# EAGLE design smarTag_v02 (EAGLE 7.5.0)
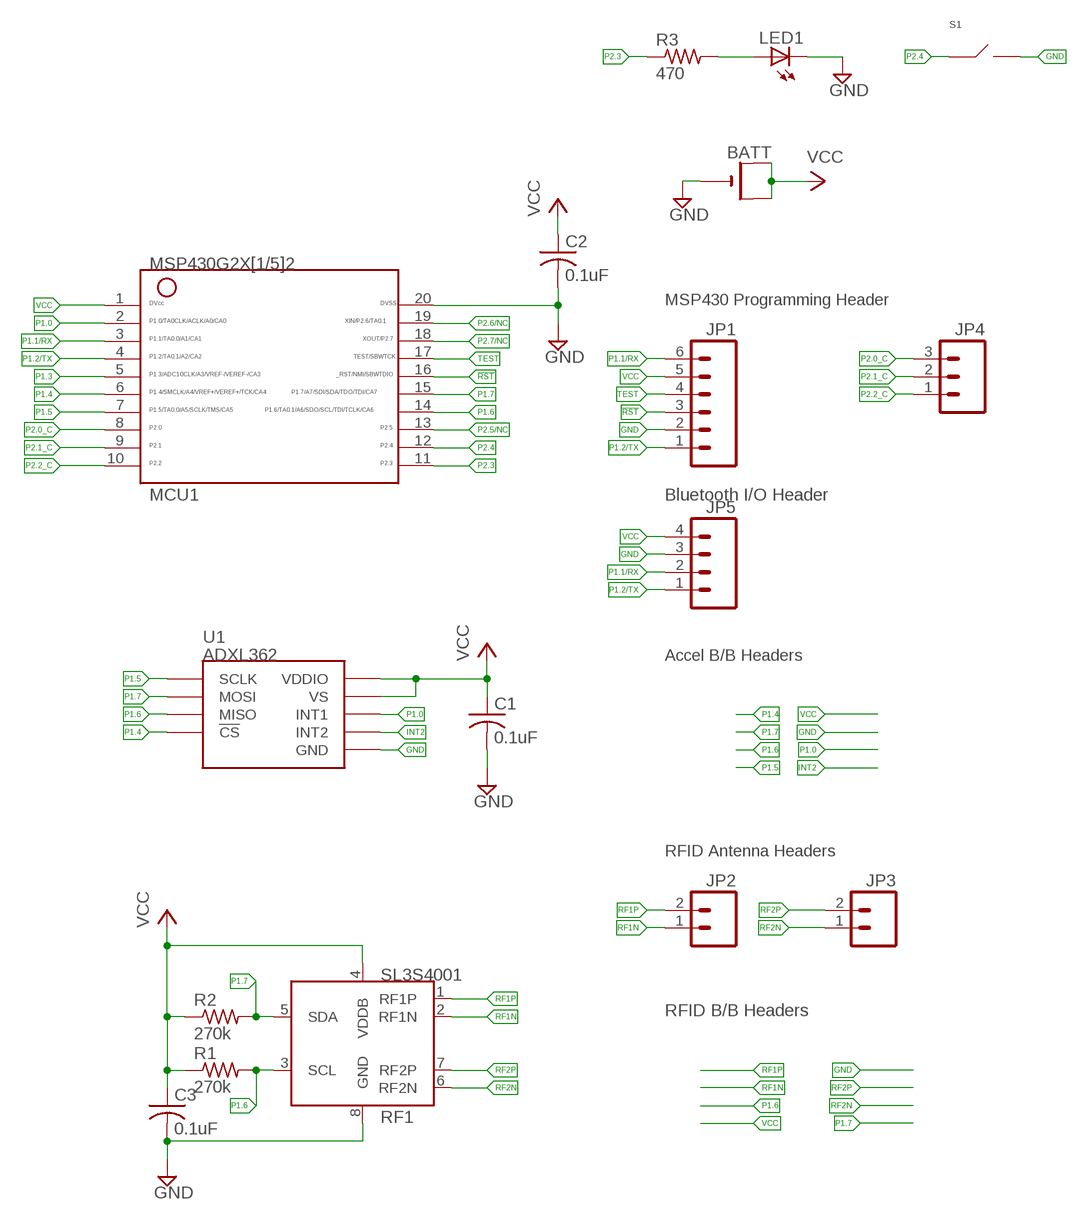
[diagram p0: schematic, sheet 1]

## Parts
BATT  CR2032SMT  [CR2032-SMD]
C1  0.1uF  C-USC0805  [C0805]
C2  0.1uF  C-USC0805K  [C0805K]
C3  0.1uF  C-USC0805  [C0805]
JP1  M061.27MM  [1X06-1.27MM]
JP2  M02LOCK  [1X02_LOCK]
JP3  M02LOCK  [1X02_LOCK]
JP4  M03LOCK  [1X03_LOCK]
JP5  M04LOCK  [1X04_LOCK]
LED1  LEDCHIP-LED0805  [CHIP-LED0805]
MCU1  G2X[1/5]2---PW20  [PW20]
R1  270k  R-US_R0805  [R0805]
R2  270k  R-US_R0805  [R0805]
R3  470  R-US_R0805  [R0805]
RF1  SL3S4001  [SOT902-1/2/3]
S1  SPST_B3FS-1000  [B3FS-1000]
U1  ADXL362  [ADXL362]

## Nets
!RST: JP1.3 MCU1.16
GND: BATT.- C1.2 C2.2 C3.2 JP1.2 JP5.3 LED1.C MCU1.20 RF1.8(GND) S1.3(B) S1.4(B) U1.P$12(GND) U1.P$13(GND) U1.P$16(GND)
INT2: U1.P$9(INT2)
N$1: LED1.A R3.2
P1.0: MCU1.2 U1.P$11(INT1)
P1.1/RX: JP1.6 JP5.2 MCU1.3
P1.2/TX: JP1.1 JP5.1 MCU1.4
P1.3: MCU1.5
P1.4: MCU1.6 U1.P$8(!CS)
P1.5: MCU1.7 U1.P$4(SCLK)
P1.6: MCU1.14 R1.2 RF1.3(SCL) U1.P$7(MISO)
P1.7: MCU1.15 R2.2 RF1.5(SDA) U1.P$6(MOSI)
P2.0_C [cap_sensor]: JP4.3 MCU1.8
P2.1_C [cap_sensor]: JP4.2 MCU1.9
P2.2_C [cap_sensor]: JP4.1 MCU1.10
P2.3: MCU1.11 R3.1
P2.4: MCU1.12 S1.1(A) S1.2(A)
P2.5/NC: MCU1.13
P2.6/NC: MCU1.19
P2.7/NC: MCU1.18
RF1N: JP2.1 RF1.2(RF1N)
RF1P: JP2.2 RF1.1(RF1P)
RF2N: JP3.1 RF1.6(RF2N)
RF2P: JP3.2 RF1.7(RF2P)
TEST: JP1.4 MCU1.17
VCC: BATT.+$1(+) BATT.+$2(+1) C1.1 C2.1 C3.1 JP1.5 JP5.4 MCU1.1 R1.1 R2.1 RF1.4(VDDB) U1.P$1(VDDIO) U1.P$14(VS)

## Notes on the sheet
- MSP430 Programming Header
- Bluetooth I/O Header
- Accel B/B Headers
- RFID Antenna Headers
- RFID B/B Headers

## Library data of the parts
BATT = adafruit:CR2032
C1-C3 = rcl:C-US: CAPACITOR, American symbol
JP1 = SparkFun-Connectors:M06: Header 6 Standard 6-pin 0.1" header. Use with straight break away headers (SKU : PRT-00116), right angle break away headers (PRT-00553), swiss pins (PRT-00743), machine pins (PRT-00117), and female headers (PRT-00115). Molex polarized connector foot print use with SKU : PRT-08094 with associated crimp pins and housings. NOTES ON THE VARIANTS LOCK and LOCK_LONGPADS... This footprint was designed to help hold the alignment of a through-hole component (i.e. 6-pin header) while soldering it into place. You may notice that each hole has been shifted either up or down by 0.005 of an inch from it's more standard position (which is a perfectly straight line). This slight alteration caused the pins (the squares in the middle) to touch the edges of the holes. Because they are alternating, it causes a "brace" to hold the component in place. 0.005 has proven to be the perfect amount of "off-center" position when using our standard breakaway headers. Although looks a little odd when you look at the bare footprint, once you have a header in there, the alteration is very hard to notice. Also,if you push a header all the way into place, it is covered up entirely on the bottom side. This idea of altering the position of holes to aid alignment will be further integrated into the Sparkfun Library for other footprints. It can help hold any component with 3 or more connection pins.
JP2 JP3 = SparkFun-Connectors:M02: Standard 2-pin 0.1" header. Use with - straight break away headers ( PRT-00116) - right angle break away headers (PRT-00553) - swiss pins (PRT-00743) - machine pins (PRT-00117) - female headers (PRT-00115) Molex polarized connector foot print use with: PRT-08233 with associated crimp pins and housings. 2.54_SCREWTERM for use with PRT-10571. 3.5mm Screw Terminal footprints for PRT-08084 5mm Screw Terminal footprints for use with PRT-08432
JP4 = SparkFun-Connectors:M03: Header 3 Standard 3-pin 0.1" header. Use with straight break away headers (SKU : PRT-00116), right angle break away headers (PRT-00553), swiss pins (PRT-00743), machine pins (PRT-00117), and female headers (PRT-00115). Molex polarized connector foot print use with SKU : PRT-08232 with associated crimp pins and housings.
JP5 = SparkFun-Connectors:M04: Header 4 Standard 4-pin 0.1" header. Use with straight break away headers (SKU : PRT-00116), right angle break away headers (PRT-00553), swiss pins (PRT-00743), machine pins (PRT-00117), and female headers (PRT-00115). Molex polarized connector foot print use with SKU : PRT-08231 with associated crimp pins and housings. 1MM SMD Version SKU: PRT-10208; PROD_ID: CONN-09696
LED1 = led:LED: LED OSRAM: - CHIPLED LG R971, LG N971, LY N971, LG Q971, LY Q971, LO R971, LY R971 LH N974, LH R974 LS Q976, LO Q976, LY Q976 LO Q996 - Hyper CHIPLED LW Q18S LB Q993, LB Q99A, LB R99A - SideLED LS A670, LO A670, LY A670, LG A670, LP A670 LB A673, LV A673, LT A673, LW A673 LH A674 LY A675 LS A676, LA A676, LO A676, LY A676, LW A676 LS A679, LY A679, LG A679 - Hyper Micro SIDELED® LS Y876, LA Y876, LO Y876, LY Y876 LT Y87S - SmartLED LW L88C, LW L88S LB L89C, LB L89S, LG L890 LS L89K, LO L89K, LY L89K LS L896, LA L896, LO L896, LY L896 - TOPLED LS T670, LO T670, LY T670, LG T670, LP T670 LSG T670, LSP T670, LSY T670, LOP T670, LYG T670 LG T671, LOG T671, LSG T671 LB T673, LV T673, LT T673, LW T673 LH T674 LS T676, LA T676, LO T676, LY T676, LB T676, LH T676, LSB T676, LW T676 LB T67C, LV T67C, LT T67C, LS T67K, LO T67K, LY T67K, LW E67C LS E67B, LA E67B, LO E67B, LY E67B, LB E67C, LV E67C, LT E67C LW T67C LS T679, LY T679, LG T679 LS T770, LO T770, LY T770, LG T770, LP T770 LB T773, LV T773, LT T773, LW T773 LH T774 LS E675, LA E675, LY E675, LS T675 LS T776, LA T776, LO T776, LY T776, LB T776 LHGB T686 LT T68C, LB T68C - Hyper Mini TOPLED® LB M676 - Mini TOPLED Santana® LG M470 LS M47K, LO M47K, LY M47K Source: http://www.osram.convergy.de LUXEON: - LUMILED® LXK2-PW12-R00, LXK2-PW12-S00, LXK2-PW14-U00, LXK2-PW14-V00 LXK2-PM12-R00, LXK2-PM12-S00, LXK2-PM14-U00 LXK2-PE12-Q00, LXK2-PE12-R00, LXK2-PE12-S00, LXK2-PE14-T00, LXK2-PE14-U00 LXK2-PB12-K00, LXK2-PB12-L00, LXK2-PB12-M00, LXK2-PB14-N00, LXK2-PB14-P00, LXK2-PB14-Q00 LXK2-PR12-L00, LXK2-PR12-M00, LXK2-PR14-Q00, LXK2-PR14-R00 LXK2-PD12-Q00, LXK2-PD12-R00, LXK2-PD12-S00 LXK2-PH12-R00, LXK2-PH12-S00 LXK2-PL12-P00, LXK2-PL12-Q00, LXK2-PL12-R00 Source: www.luxeon.com KINGBRIGHT: KA-3528ASYC Source: www.kingbright.com
MCU1 = TI_MSP430_v16:G2X[1/5]2---PW20: MSP430G2X[1/5]2 MSP430G2x52, MSP430G2x12 TSSOP (PW) 20 Pin Package http://focus.ti.com/docs/prod/folders/print/msp430g2452.html
R1-R3 = rcl:R-US_: RESISTOR, American symbol
RF1 = NXP_60_26022015:SL3S4001: The UHF EPCglobal Generation 2 standard allows the commercialized provision of mass adoption of UHF RFID technology for passive smart tags and labels. Main fields of applications are supply chain management and logistics for worldwide use with special consideration of European, US and Chinese frequencies to ensure that operating distances of several meters can be realized. The UCODE I2C is a product out of the NXP Semiconductors UCODE product family. The entire UCODE product family offers anti-collision and collision arbitration functionality. This allows a reader to simultaneously operate multiple labels/tags within its antenna field. A UCODE I2C based label/ tag requires no external power supply for contactless operation. Its contactless interface generates the power supply via the antenna circuit by propagative energy transmission from the interrogator (reader), while the system clock is generated by an on-chip oscillator. Data transmitted from the interrogator to the label/tag is demodulated by the interface, and it also modulates the interrogator's electromagnetic field for data transmission from the label/tag to the interrogator. A label/tag can be operated without the need for line of sight or battery, as long as it is connected to a dedicated antenna for the targeted frequency range. When the label/tag is within the interrogator's operating range, the high-speed wireless interface allows data transmission in both directions. The UCODE I2C also features an I2C interface to read/write data from its build in memory. In this mode the UCODE I2C needs to be supplied externally. The I2C interface supports standard and fast I2C modes. The used EEPROM is based on a field proven non-volatile memory technology. The EEPROM memory cell is also used in high quality automotive applications. AAL Eindhoven MK
S1 = PP_Electromechanical:SPST: SPST Switches
U1 = SparkFun-Sensors:ADXL362: Micropower 3-axis accelerometer 2/4/8g digital output (SPI) IC-11297; PROD_ID: IC-11297

## Net classes
0 default: width 0.254 mm
1 cap_sensor: width 0.254 mm

## Board
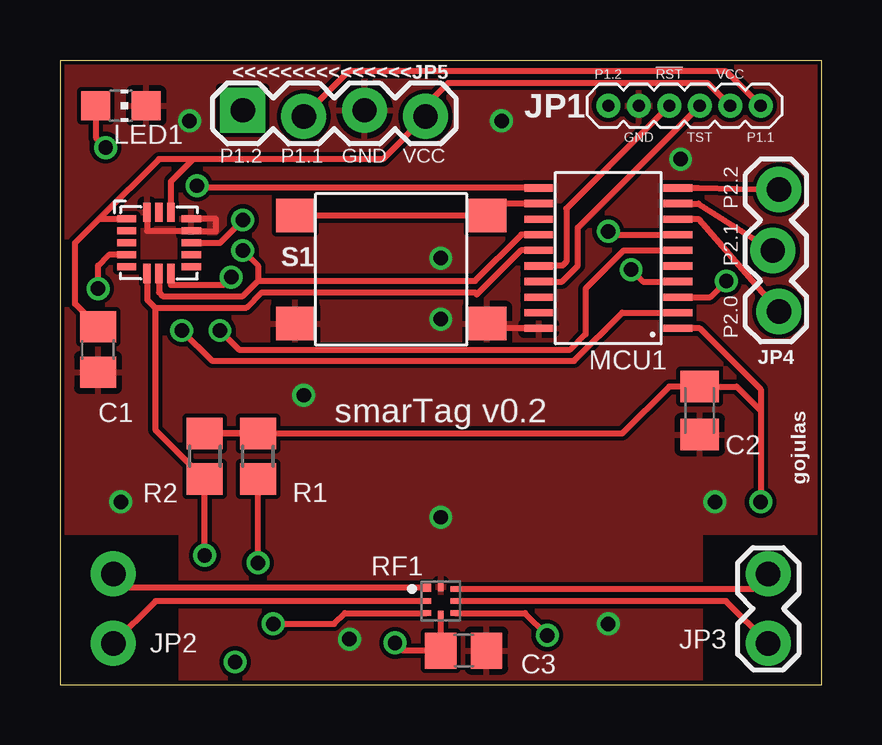
[diagram p1: board, top side]
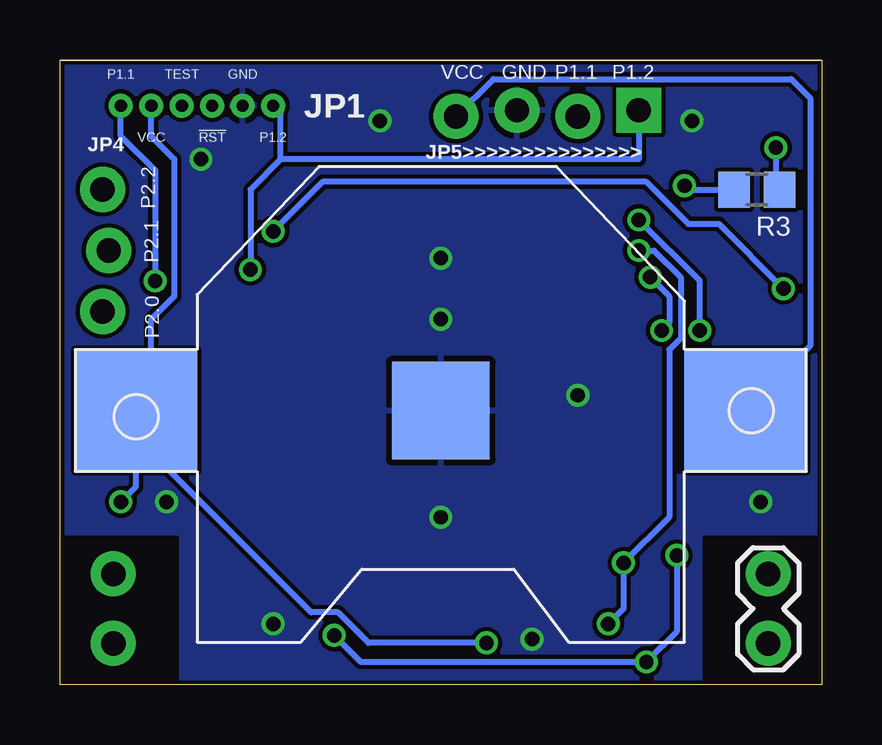
[diagram p2: board, bottom side, seen from below]

Size 31.75 x 26.04 mm. Coordinates in mm from the lower left corner, seen from the top.
Outline: 31.75,26.02 31.75,0 0,0 0,26.02 31.75,26.02
Outline: 31.75,26.02 31.75,26.04
Copper layers (1*16): Top 0.035mm / dielectric 1.5mm / Bottom 0.035mm
Design rules "SparkFun-2-layer-TIGHT *": minimum track width 7mil, minimum drill 15mil, track to track 7mil, track to pad 7mil, pad to pad 7mil, via to via 7mil, smd to smd 7mil, copper to edge 7mil, drill to drill 7mil, minimum pad ring 7mil, minimum via ring 7mil, stop-mask expansion 4mil, vias tented up to drill 25mil, thermal gap 10mil

### Footprints (pad centres in the part's own frame; a part is rotated, then mirrored left to right if it is on the bottom)
CR2032-SMD = smd 5.08 x 5.08: +$1 -12.7,0; +$2 12.7,0 | smd 4.064 x 4.064: - 0,0
C0805 = smd 1.3 x 1.5: 1 -0.95,0; 2 0.95,0
C0805K = smd 1.3 x 1.6: 1 -1,0; 2 1,0
1X06-1.27MM = drill 0.508 pad 1: 1 0,0; 2 1.27,0; 3 2.54,0; 4 3.81,0; 5 5.08,0; 6 6.35,0
1X02_LOCK = drill 1.016 pad 1.88: 1 -0.178,0; 2 2.718,0
1X03_LOCK = drill 1.016 pad 1.88: 1 0,0.127; 2 2.54,-0.127; 3 5.08,0.127
1X04_LOCK = drill 1.016 pad 1.88 square: 1 0,0.127 | drill 1.016 pad 1.88: 2 2.54,-0.127; 3 5.08,0.127; 4 7.62,-0.127
CHIP-LED0805 = smd 1.2 x 1.2: A 0,-1.05; C 0,1.05
PW20 = smd 0.3 x 1.2: 1 -2.925,-2.9; 2 -2.275,-2.9; 3 -1.625,-2.9; 4 -0.975,-2.9; 5 -0.325,-2.9; 6 0.325,-2.9; 7 0.975,-2.9; 8 1.625,-2.9; 9 2.275,-2.9; 10 2.925,-2.9; 11 2.925,2.9; 12 2.275,2.9; 13 1.625,2.9; 14 0.975,2.9; 15 0.325,2.9; 16 -0.325,2.9; 17 -0.975,2.9; 18 -1.625,2.9; 19 -2.275,2.9; 20 -2.925,2.9
R0805 = smd 1.3 x 1.5: 1 -0.95,0; 2 0.95,0
SOT902-1/2/3 = smd 0.4 x 0.32: 1 0.6,-0.55 | smd 0.4 x 0.22: 2 0.6,0; 3 0.6,0.5; 5 -0.6,0.5; 6 -0.6,0; 7 -0.6,-0.5 | smd 0.22 x 0.4: 4 0,0.6; 8 0,-0.6
B3FS-1000 = smd 1.6 x 1.4: 1 4,-2.25; 2 -4,-2.25; 3 4,2.25; 4 -4,2.25
ADXL362 = smd 0.8 x 0.3: P$1 -1.35,1; P$2 -1.35,0.5; P$3 -1.35,0; P$4 -1.35,-0.5; P$5 -1.35,-1; P$9 1.35,-1; P$10 1.35,-0.5; P$11 1.35,0; P$12 1.35,0.5; P$13 1.35,1 | smd 0.3 x 0.8: P$6 -0.5,-1.275; P$7 0,-1.275; P$8 0.5,-1.275; P$14 0.5,1.275; P$15 0,1.275; P$16 -0.5,1.275

### Placement (x,y rotation side)
BATT  15.88,11.43 180 bottom
C1  1.59,13.97 270 top
C2  26.67,11.43 270 top
C3  16.83,1.43 0 top
JP1  22.86,24.13 0 top
JP2  2.22,1.91 90 bottom
JP3  29.53,1.91 90 top
JP4  29.84,20.64 270 top
JP5  7.62,23.81 0 top
LED1  2.54,24.13 270 top
MCU1  22.86,17.78 90 top
R1  8.26,9.53 270 top
R2  6.03,9.53 270 top
R3  2.7,20.64 0 bottom
RF1  15.88,3.49 180 top
S1  13.81,17.3 180 top
U1  4.13,18.41 0 top

### Tracks (layer width: path | path; a pad name or v marks a point on that pad's centre or on a via)
!RST
  Top 0.254: MCU1.16 20.95,17.46 21.11,17.62 21.11,19.84 JP1.3
GND  (via drill 0.6)
  Top 0.254: U1.P$16 3.63,18.91 U1.P$12 5.48,18.89 6.51,18.89 6.51,19.41 U1.P$13 | MCU1.20 18.01,14.86 S1.4
  other vias: 27.3,7.62 22.86,2.54 2.54,7.62 15.88,15.24 10.16,12.06 15.88,6.99 25.88,21.91 5.4,23.5 15.88,17.78 18.41,23.5 12.06,1.91
  pour Top: -2.54,30.48 34.29,30.48 34.29,6.35 26.67,6.35 26.67,-2.54 5.08,-2.54 5.08,6.35 -2.54,6.35
  pour Bottom: -1.27,6.35 -1.27,29.21 33.02,29.21 33.02,6.35 26.67,6.35 26.67,-1.27 5.08,-1.27 5.08,6.35
N$1  (via drill 0.6)
  Top 0.254: LED1.A 1.49,22.8 v1.91,22.38
  Bottom 0.254: v1.91,22.38 1.91,20.64 R3.2
P1.0  (via drill 0.6)
  Top 0.254: v5.08,14.76 6.35,13.49 21.43,13.49 23.44,15.51 MCU1.2 | U1.P$11 6.67,18.41 v7.62,19.37
  Bottom 0.254: v5.08,14.76 5.08,16.83 v7.62,19.37
P1.1/RX  (via drill 0.6)
  Top 0.254: JP5.2 12.03,25.56 27.78,25.56 JP1.6 | MCU1.3 27.11,16.16 v27.78,16.83
  Bottom 0.254: v27.78,16.83 27.78,21.43 29.21,22.86 JP1.6
P1.2/TX  (via drill 0.6)
  Top 0.254: MCU1.4 24.31,16.8 v23.81,17.3
  Bottom 0.254: JP5.1 7.62,21.91 22.54,21.91 | 22.54,21.91 23.81,20.64 v23.81,17.3 | 22.54,21.91 22.54,23.81 JP1.1
P1.4  (via drill 0.6)
  Top 0.254: MCU1.6 25.75,18.1 23.5,18.1 21.91,16.51 21.91,14.61 21.27,13.97 7.46,13.97 v6.67,14.76 | U1.P$8 4.63,16.67 6.83,16.67 v7.14,16.99
  Bottom 0.254: v6.67,14.76 6.35,15.08 6.35,16.19 v7.14,16.99
P1.5  (via drill 0.6)
  Top 0.254: MCU1.7 25.74,18.73 23.02,18.73 v22.86,18.89 | U1.P$4 2.04,17.91 1.59,17.46 v1.59,16.51
  Bottom 0.254: v1.59,16.51 4.29,19.21 5.56,19.21 7.3,20.95 20.8,20.95 v22.86,18.89
P1.6  (via drill 0.6)
  Top 0.254: v8.26,5.08 R1.2 | U1.P$7 4.13,16.35 4.29,16.19 7.62,16.19 8.26,16.83 | RF1.3 11.88,2.99 11.43,2.54 v8.89,2.54 | MCU1.14 19.23,18.75 17.3,16.83 8.26,16.83 | v7.62,18.1 8.26,17.46 8.26,16.83
  Bottom 0.254: v8.89,2.54 8.26,3.17 v8.26,5.08 6.35,6.99 6.35,13.97 5.87,14.45 5.87,16.99 6.99,18.1 v7.62,18.1
P1.7  (via drill 0.6)
  Top 0.254: v6.03,5.4 R2.2 3.97,10.64 3.97,15.72 | 3.97,15.72 3.65,16.03 3.65,17.12 U1.P$6 | RF1.5 19.39,2.99 v20.32,2.06 | MCU1.15 19.22,18.11 17.38,16.27 17.3,16.35 8.41,16.35 7.78,15.72 3.97,15.72
  Bottom 0.254: v20.32,2.06 19.21,0.95 v7.3,0.95 6.03,2.22 v6.03,5.4
P2.0_C
  Top 0.254: MCU1.8 26.63,19.41 JP4.3
P2.1_C
  Top 0.254: MCU1.9 26.62,20.05 JP4.2
P2.2_C
  Top 0.254: MCU1.10 26.6,20.7 JP4.1
P2.3  (via drill 0.6)
  Top 0.254: MCU1.11 5.81,20.7 v5.71,20.8
  Bottom 0.254: v5.71,20.8 5.56,20.64 R3.1
P2.4
  Top 0.254: MCU1.12 18.31,20.05 S1.2 S1.1
RF1N
  Top 0.254: 2.72,2.22 JP2.1 3.99,3.49 RF1.2
RF1P
  Top 0.254: RF1.1 2.8,4.04 JP2.2
RF2N
  Top 0.254: JP3.1 27.76,3.49 RF1.6
RF2P
  Top 0.254: JP3.2 28.9,3.99 RF1.7
TEST
  Top 0.254: MCU1.17 20.93,16.8 21.59,17.46 21.59,19.05 JP1.4
VCC  (via drill 0.6)
  Top 0.254: MCU1.1 26.67,14.86 29.21,12.31 29.21,11.43 | C1.1 0.64,15.87 0.64,18.41 1.64,19.41 | 1.64,19.41 U1.P$1 | R1.1 R2.1 23.45,10.47 25.4,12.43 C2.1 28.21,12.43 29.21,11.43 | RF1.4 C3.1 14.29,1.43 v13.97,1.75 | 5.56,21.91 13.46,21.91 JP5.4 15.24,24.13 16.19,25.08 26.99,25.08 JP1.5 | 5.56,21.91 4.13,21.91 1.64,19.41 | U1.P$14 4.63,20.98 5.56,21.91 | 29.21,11.43 v29.21,7.62
  Bottom 0.254: 3.17,9.53 BATT.+$1 0.48,14.13 0.48,24.45 1.27,25.24 13.68,25.24 JP5.4 | v13.97,1.75 18.89,1.75 20.16,3.02 21.27,3.02 28.57,10.32 BATT.+$2 | JP1.5 27.94,22.86 26.99,21.91 26.99,16.19 27.94,15.24 27.94,12.06 BATT.+$2 | v29.21,7.62 28.57,8.26 BATT.+$2

### Text on the board
tPlace: JP4
tNames: <<<<<<<<<<<<<<<JP5 | P1.2 | !RST | VCC | JP1 | GND | TST | P1.1 | P1.2 | P1.1 | GND | VCC | P2.2 | P2.1 | P2.0 | smarTag v0.2 | gojulas
bNames: P1.2 | P1.1 | GND | VCC | GND | TEST | P1.1 | JP1 | P1.2 | !RST | VCC | JP5>>>>>>>>>>>>>>> | JP4 | P2.2 | P2.1 | P2.0